# EasyEDA Pro project ProPrj_三轮车_2025-08-24.epro, board PCB1
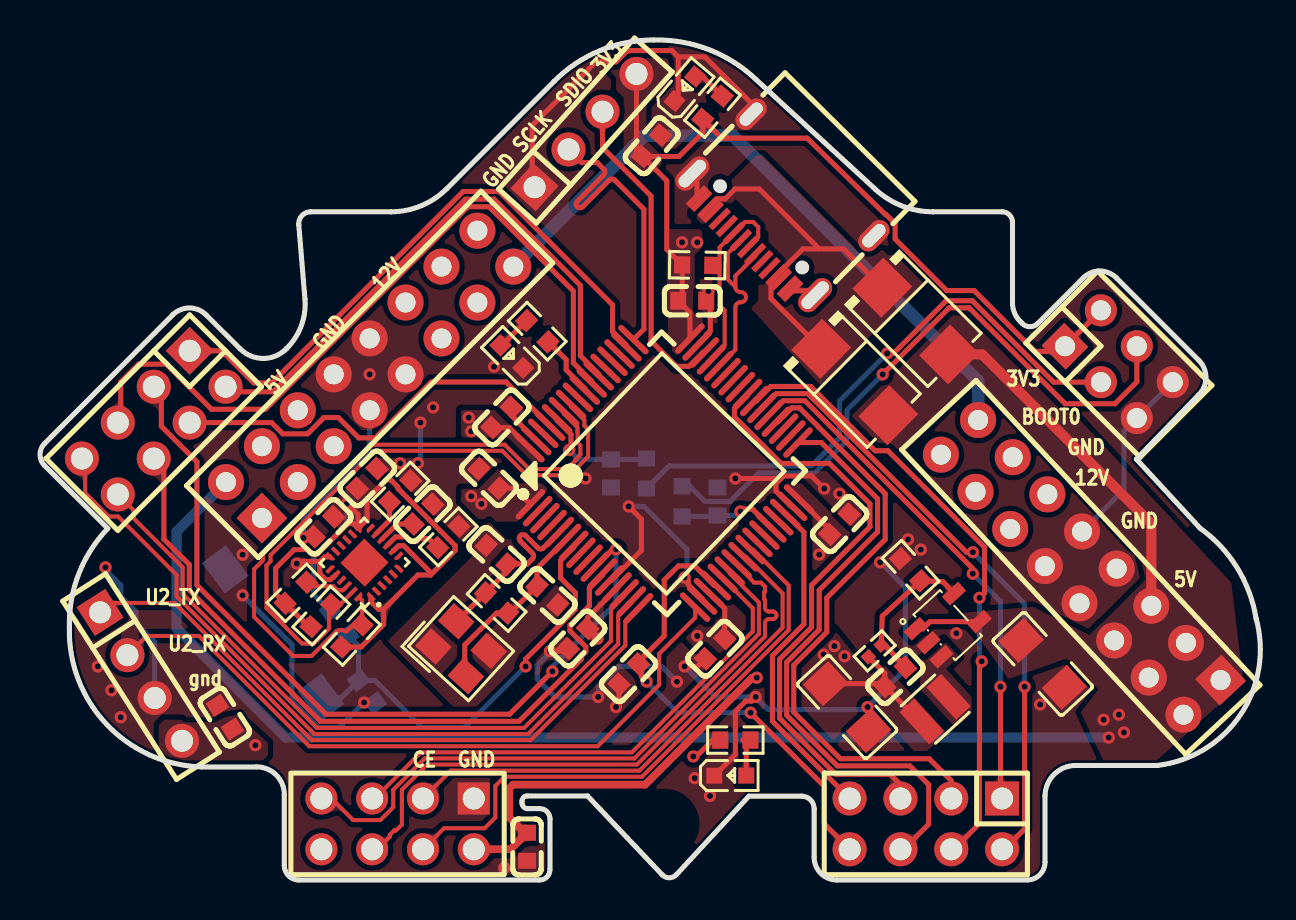
[diagram p6: board, top side]
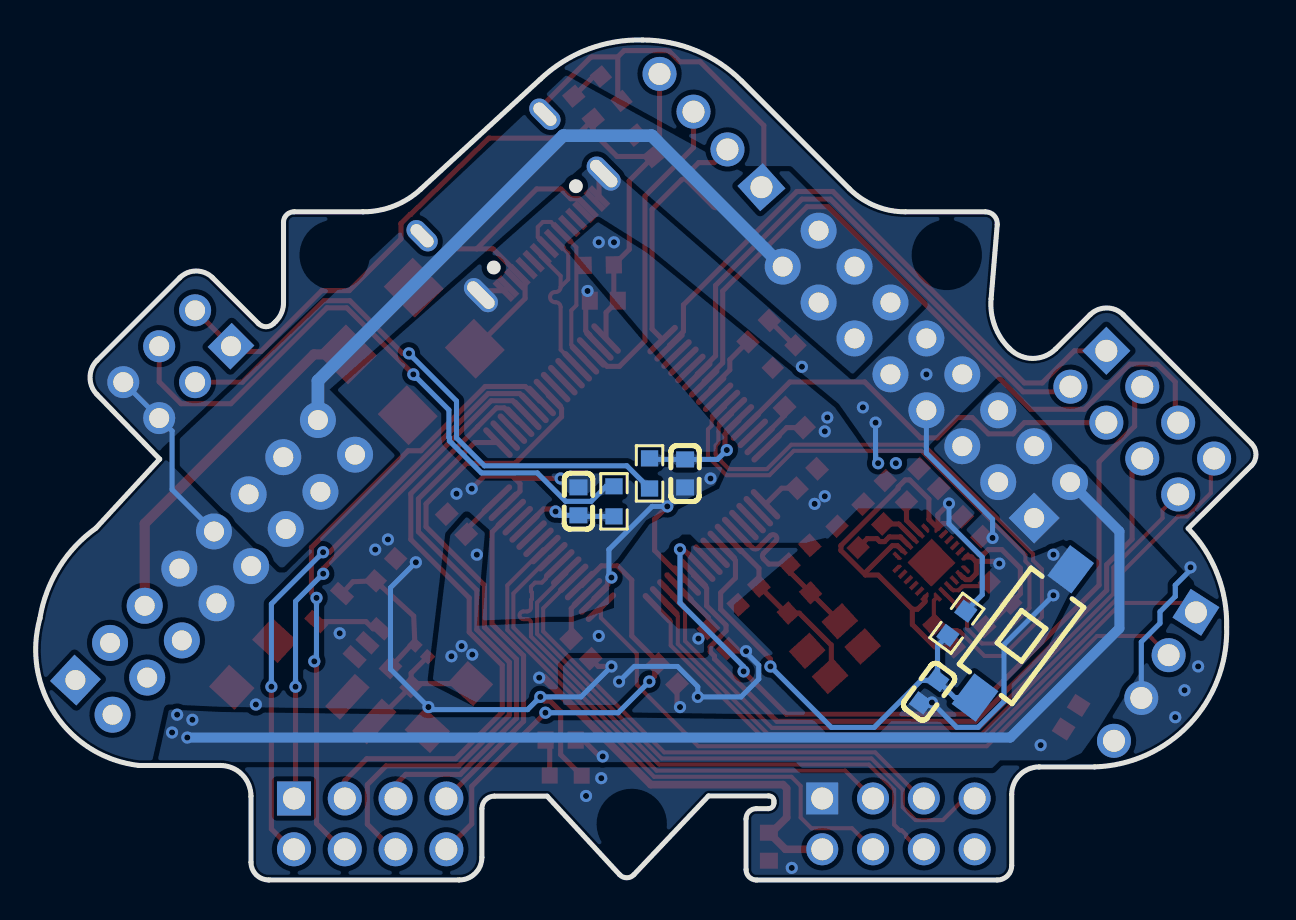
[diagram p7: board, bottom side, seen from below]

Outline 61.02 x 42.01 mm; copper layers: Top Layer, Bottom Layer. Coordinates in mm from the lower left corner of the outline.
Outline path: 0.23,21.82 6.63,28.26 arc(7.47,28.61) 8.3,28.26 10.02,26.55 arc(11.16,26.08) 12.31,26.56 12.35,26.6 arc(13.07,27.72) 13.25,29.05 12.94,32.77 arc(13.09,33.22) 13.53,33.41 17.54,33.41 arc(19.06,33.71) 20.34,34.57 25.71,39.94 arc(27.98,41.47) 30.67,42.01 arc(33.43,41.53) 35.8,40.03 41.77,34.54 arc(43.11,33.7) 44.65,33.41 48.11,33.41 arc(48.48,33.26) 48.63,32.89 48.63,28.86 arc(48.73,28.36) 49.01,27.94 49.12,27.83 arc(49.5,27.67) 49.88,27.83 52.17,30.11 arc(53,30.45) 53.82,30.11 57.95,25.98 arc(58.3,25.14) 57.96,24.29 54.82,21.05 58.01,17.59 arc(59.86,15.62) 60.81,13.09 arc(60.03,8.27) 55.85,5.73 51.79,5.73 arc(50.7,5.28) 50.26,4.19 50.26,0.89 arc(50,0.26) 49.37,0 39.84,0 arc(39.04,0.33) 38.71,1.14 38.71,3.57 arc(38.53,4.01) 38.08,4.19 35.45,4.19 31.82,0.27 arc(31.47,0.11) 31.11,0.26 27.38,4.2 24.36,4.2 arc(24.18,4.13) 24.1,3.95 24.1,3.85 arc(24.19,3.65) 24.38,3.57 24.99,3.57 arc(25.35,3.42) 25.5,3.06 25.5,0.52 arc(25.35,0.15) 24.98,0 12.94,0 arc(12.43,0.21) 12.22,0.72 12.22,4.28 arc(11.81,5.25) 10.84,5.66 8.06,5.66 arc(3.32,7.79) 1.47,12.66 arc(1.94,15.31) 3.39,17.58 0.23,20.72 arc(0,21.27) 0.23,21.82
Stack: Top Layer 0.035mm / Dielectric1 1.51mm FR4 er 4.5 / Bottom Layer 0.035mm

## Design rules (mm)
net PA12: DP1
net PA11: DP1
template: 自定义配置
spacing copperThickness1oz (default): track to track 0.102, other pairs 0.152 to 0.3
spacing copperThickness2oz: track to track 0.203, other pairs 0.152 to 0.3
track width copperThickness1oz (default): min 0.127, default 0.254, max 2.54
track width copperThickness2oz: min 0.203, default 0.254, max 2.54
differential pair differentialPair (default): width min 0.127, default 0.254, max 2.54; gap min 0.152, default 0.152
via viaSize (default): diameter min 0.5, default 0.61, max 10; hole min 0.3, default 0.305, max 6.3

## Placement (name value [footprint] x y rotation side)
C16  20PF  [C0603]  22.83 16.27 317.7 top
C17  20PF  [C0603]  25.37 14.24 137.7 top
C20  100nF  [C0603]  16.34 9.42 126.5 bottom
C21  100nF  [C0603]  28.55 20.33 90 bottom
C22  100nF  [C0603]  33.88 18.94 270 bottom
C25  22uF  [C1206]  50.14 10.81 132.6 top
C26  22uF  [C1206]  40.36 8.65 312.6 top
C27  100pF  [C0603]  42.76 10.16 222.6 top
C32  100nF  [C0603]  30.58 36.72 229.8 top
C64  100nF  [C0603]  23.09 23.13 226.1 top
C65  100nF  [C0603]  24.36 1.66 90 top
C66  100nF  [C0603]  39.98 17.79 226.1 top
C67  100nF  [C0603]  26.9 12.08 46.1 top
C68  100nF  [C0603]  22.45 20.08 316.1 top
C69  100nF  [C0603]  33.75 11.57 46.1 top
C70  100nF  [C0603]  32.61 28.97 180 top
C71  10nF  [C0603]  14.2 17.67 45.2 top
C72  100nF  [C0603]  16.36 20.08 225.2 top
C73  100nF  [C0603]  19.15 18.3 45.2 top
C74  100nF  [C0603]  9.24 8.14 302.5 top
C75  100nF  [C0603]  29.44 10.3 46.1 top
D1  VS-10BQ015HM3/5BT  [SMB_L4.6-W3.6-LS5.3-RD]  43.79 27.95 315 top
D2  VS-10BQ015HM3/5BT  [SMB_L4.6-W3.6-LS5.3-RD]  40.74 24.9 315.3 top
H7  -  [HDR-TH_6P-P2.54-V-F-R2-C3-S2.54]  53.95 25.79 315 top
H8  PZ254V-11-04P  [HDR-TH_4P-P2.54-V-M]  27.28 37.48 48 top
H9  PZ254V-12-8P  [HDR-TH_8P-P2.54-V-M-R2-C4-S2.54]  5.69 22.87 225 top
H10  PZ254V-12-8P  [HDR-TH_8P-P2.54-V-M-R2-C4-S2.54]  44.3 2.81 180 top
J1  2.54-2*8P母  [HDR-TH_16P-P2.54-V-F-R2-C8-S2.54]  52.04 15.63 133 top
J2  2.54-2*8P母  [HDR-TH_16P-P2.54-V-F-R2-C8-S2.54#2]  16.48 25.29 45 top
L3  2.2uH  [IND-SMD_L2.5-W2.0_MHCD252012A]  44.76 8.54 222.6 top
LED3  XL-1608SURC-06  [LED0603-RD_RED]  34.52 5.22 0 top
LED9  XL-1608SURC-06  [LED0603-RD_RED]  32.24 39.57 49.8 top
LED10  XL-1608SURC-06  [LED0603-RD_RED]  23.59 26.17 135 top
R5  10kΩ  [R0603]  34.77 7 0 top
R13  10kΩ  [R0603]  22.83 13.86 317.7 top
R14  10kΩ  [R0603]  14.96 12.84 126.5 bottom
R15  10kΩ  [R0603]  32.1 18.94 90 bottom
R16  10kΩ  [R0603]  30.33 20.33 90 bottom
R31  450kΩ  [R0402]  41.74 11.46 222.6 top
R32  100kΩ  [R0603]  43.53 15.52 132.6 top
R45  10kΩ  [R0603]  33.63 38.62 49.8 top
R47  1.5kΩ  [R0603]  32.87 30.75 358.9 top
R48  10kΩ  [R0603]  12.8 14.36 44.2 top
R49  10kΩ  [R0603]  15.59 12.2 47 top
R50  10kΩ  [R0603]  14.07 13.22 47 top
R51  10kΩ  [R0603]  18.01 19.44 45.2 top
R52  10kΩ  [R0603]  20.42 17.16 45.2 top
R53  10kΩ  [R0603]  24.86 27.44 135 top
SW8  TS-1101-C-W  [SW-SMD_L6.0-W3.3-LS8.0]  11.66 12.33 126.7 bottom
U2  2.54-2*4  [HDR-TH_8P-P2.54-V-F-R2-C4-S2.54]  17.88 2.81 180 top
U24  ME3103AM5G  [SOT-23-5_L3.0-W1.7-P0.95-LS2.8-BR]  45.39 12.74 222.6 top
U33  STM32F103RCT6TR  [LQFP-64_L10.0-W10.0-P0.50-LS12.0-BL]  31.21 20.33 316.1 top
U34  MPU-9250  [QFN-24_L3.0-W3.0-P0.40-BL-EP]  16.23 15.87 45.5 top
U35  PM254-1-04-Z-8.5  [HDR-TH_4P-P2.54-V-F]  5.05 10.17 302.5 top
USB2  KH-TYPE-C-16P  [usb-c-smd_kh-type-c-16p]  36.93 33.54 135.3 top
X1  8MHz  [CRYSTAL-SMD_4P-L3.2-W2.5-BL]  21.05 11.57 317.7 top

## Footprints (pads in the part's own frame, mm; a bottom-side part is the same pattern mirrored in y, then rotated)
C0603
  rect 0.8x0.9 smd: 1(-0.7,0) 2(0.7,0)
C1206
  rect 1.485x1.728 smd: 1(-1.593,0) 2(1.593,0)
CRYSTAL-SMD_4P-L3.2-W2.5-BL
  rect 1.4x1.2 smd: 1(-1.1,-0.85) 2(1.1,-0.85) 3(1.1,0.85) 4(-1.1,0.85)
HDR-TH_4P-P2.54-V-F
  rect 1.7x1.7 hole 1.1: 1(-3.81,0)
  round 1.7 hole 1.1: 2(-1.27,0) 3(1.27,0) 4(3.81,0)
HDR-TH_4P-P2.54-V-M
  rect 1.7x1.7 hole 1.1: 1(-3.81,0)
  round 1.7 hole 1.1: 2(-1.27,0) 3(1.27,0) 4(3.81,0)
HDR-TH_6P-P2.54-V-F-R2-C3-S2.54
  rect 1.7x1.6 hole 1: 1(-2.54,-1.27)
  round 1.6 hole 1: 2(-2.54,1.27) 3(0,-1.27) 4(0,1.27) 5(2.54,-1.27) 6(2.54,1.27)
HDR-TH_8P-P2.54-V-F-R2-C4-S2.54
  rect 1.6x1.6 hole 1.1: 1(-3.81,-1.27)
  round 1.6 hole 1.1: 2(-3.81,1.27) 3(-1.27,-1.27) 4(-1.27,1.27) 5(1.27,-1.27) 6(1.27,1.27) 7(3.81,-1.27) 8(3.81,1.27)
HDR-TH_8P-P2.54-V-M-R2-C4-S2.54
  rect 1.7x1.7 hole 1.1: 1(-3.81,-1.27)
  round 1.7 hole 1.1: 2(-3.81,1.27) 3(-1.27,-1.27) 4(-1.27,1.27) 5(1.27,-1.27) 6(1.27,1.27) 7(3.81,-1.27) 8(3.81,1.27)
HDR-TH_16P-P2.54-V-F-R2-C8-S2.54
  rect 1.8x1.8 hole 1: 1(-8.89,-1.27)
  round 1.8 hole 1: 2(-8.89,1.27) 3(-6.35,-1.27) 4(-6.35,1.27) 5(-3.81,-1.27) 6(-3.81,1.27) 7(-1.27,-1.27) 8(-1.27,1.27) 9(1.27,-1.27) 10(1.27,1.27) 11(3.81,-1.27) 12(3.81,1.27) 13(6.35,-1.27) 14(6.35,1.27) 15(8.89,-1.27) 16(8.89,1.27)
HDR-TH_16P-P2.54-V-F-R2-C8-S2.54#2
  rect 1.8x1.8 hole 1: 1(-8.89,-1.27)
  round 1.8 hole 1: 2(-8.89,1.27) 3(-6.35,-1.27) 4(-6.35,1.27) 5(-3.81,-1.27) 6(-3.81,1.27) 7(-1.27,-1.27) 8(-1.27,1.27) 9(1.27,-1.27) 10(1.27,1.27) 11(3.81,-1.27) 12(3.81,1.27) 13(6.35,-1.27) 14(6.35,1.27) 15(8.89,-1.27) 16(8.89,1.27)
IND-SMD_L2.5-W2.0_MHCD252012A
  rect 1x2.2 smd: 1(0.913,0) 2(-0.913,0)
LED0603-RD_RED
  rect 0.8x0.8 smd: 1(-0.799,-0.004) 2(0.799,0.004)
LQFP-64_L10.0-W10.0-P0.50-LS12.0-BL
  oval 0.3x2 smd: 1(-3.75,-5.75) 2(-3.25,-5.75) 3(-2.75,-5.75) 4(-2.25,-5.75) 5(-1.75,-5.75) 6(-1.25,-5.75) 7(-0.75,-5.75) 8(-0.25,-5.75) 9(0.25,-5.75) 10(0.75,-5.75) 11(1.25,-5.75) 12(1.75,-5.75) 13(2.25,-5.75) 14(2.75,-5.75) 15(3.25,-5.75) 16(3.75,-5.75) 33(3.75,5.75) 34(3.25,5.75) 35(2.75,5.75) 36(2.25,5.75) 37(1.75,5.75) 38(1.25,5.75) 39(0.75,5.75) 40(0.25,5.75) 41(-0.25,5.75) 42(-0.75,5.75) 43(-1.25,5.75) 44(-1.75,5.75) 45(-2.25,5.75) 46(-2.75,5.75) 47(-3.25,5.75) 48(-3.75,5.75)
  oval 2x0.3 smd: 17(5.75,-3.75) 18(5.75,-3.25) 19(5.75,-2.75) 20(5.75,-2.25) 21(5.75,-1.75) 22(5.75,-1.25) 23(5.75,-0.75) 24(5.75,-0.25) 25(5.75,0.25) 26(5.75,0.75) 27(5.75,1.25) 28(5.75,1.75) 29(5.75,2.25) 30(5.75,2.75) 31(5.75,3.25) 32(5.75,3.75) 49(-5.75,3.75) 50(-5.75,3.25) 51(-5.75,2.75) 52(-5.75,2.25) 53(-5.75,1.75) 54(-5.75,1.25) 55(-5.75,0.75) 56(-5.75,0.25) 57(-5.75,-0.25) 58(-5.75,-0.75) 59(-5.75,-1.25) 60(-5.75,-1.75) 61(-5.75,-2.25) 62(-5.75,-2.75) 63(-5.75,-3.25) 64(-5.75,-3.75)
QFN-24_L3.0-W3.0-P0.40-BL-EP
  custom 0.2x0.506 smd: 1(-1,-1.427) 6(1,-1.427) 13(1,1.427) 18(-1,1.427)
  rect 0.2x0.505 smd: 2(-0.6,-1.427) 3(-0.2,-1.427) 4(0.2,-1.427) 5(0.6,-1.427) 14(0.6,1.427) 15(0.2,1.427) 16(-0.2,1.427) 17(-0.6,1.427)
  custom 0.506x0.2 smd: 7(1.427,-1) 12(1.427,1) 19(-1.427,1) 24(-1.427,-1)
  rect 0.505x0.2 smd: 8(1.427,-0.6) 9(1.427,-0.2) 10(1.427,0.2) 11(1.427,0.6) 20(-1.427,0.6) 21(-1.427,0.2) 22(-1.427,-0.2) 23(-1.427,-0.6)
  rect 1.7x1.7 smd: 25(0,0)
R0402
  rect 0.566x0.54 smd: 1(-0.433,0) 2(0.433,0)
R0603
  rect 0.806x0.864 smd: 1(-0.753,0) 2(0.753,0)
SMB_L4.6-W3.6-LS5.3-RD
  rect 2.047x2.192 smd: 1(-2.361,0) 2(2.361,0)
SOT-23-5_L3.0-W1.7-P0.95-LS2.8-BR
  rect 1.1x0.6 smd: 1(1.3,-0.95) 2(1.3,0) 3(1.3,0.95) 4(-1.3,0.95) 5(-1.3,-0.95)
SW-SMD_L6.0-W3.3-LS8.0
  rect 1.9x1.5 smd: 1(-4,0) 2(4,0)
usb-c-smd_kh-type-c-16p
  oval 1x2 hole 0.6x1.7: 1(-4.32,1.765) 2(4.32,1.765)
  oval 1x1.8 hole 0.6x1.4: 3(-4.32,-2.415) 4(4.32,-2.415)
  rect 0.3x1.3 smd: A1(-3.35,2.415) A4(-2.55,2.415) A5(-1.25,2.415) A6(-0.25,2.415) A7(0.25,2.415) A8(1.25,2.415) A9(2.55,2.415) A12(3.35,2.415) B1(3.05,2.415) B4(2.25,2.415) B5(1.75,2.415) B6(0.75,2.415) B7(-0.75,2.415) B8(-1.75,2.415) B9(-2.25,2.415) B12(-3.05,2.415)

## Nets
As in the schematic, except:
$3N1256: L3.2 U24.3
$3N1257: C27.1 R31.1 R32.1 U24.5

Pads without a net: U34 2 3 4 5 6 7 12 14 15 16 17 19 21 25; USB2 A5 A8 B5 B8

## Via types
v1: diameter 0.61, hole 0.305, Top Layer to Bottom Layer, 72 vias

## Routing (per net, layer and track width the routed paths; a pad name or vN(x,y) marks a point on that pad's centre or on a via; arc(x,y) is an arc through that point)
3V3: length 121.2
  Top Layer w0.254: C27.2 42.25,10.34 R31.2 ; C27.2 44,7.93 L3.1 ; C27.2 42.11,9.82 C26.1 ; U33.32 39.49,17.51 C66.2 ; U33.1 23.72,19.59 C68.2 ; 53.05,28.49 H7.1 50.99,26.43 49.76,26.43 46.71,29.48 45.34,29.48 42.76,32.05 42.76,32.82 42.3,33.28 42.27,33.28 38.36,37.1 34.09,37.1 R45.1 33.14,37.37 31.95,36.18 C32.2 ; C64.2 23.47,22.62 U33.64 ; 17.18,13.54 16.93,13.54 16.54,13.92 U34.1 ; 17.18,13.54 17.18,12.78 16.06,11.65 R49.1 ; 17.18,13.54 18.9,15.25 19.53,15.25 ; R50.1 13.43,12.67 11.78,14.31 11.78,15.59 12.71,16.52 13.39,16.52 13.62,16.29 13.86,16.29 15.36,17.79 15.37,17.79 15.4,17.83 15.67,17.83 U34.13 ; U34.13 15.91,18.27 v1(15.35,18.83) ; U34.13 16.36,18.03 16.36,19.05 17.32,20.01 17.54,20.01 17.89,19.65 17.89,19.58 20.76,16.72 20.76,16.48 19.53,15.25 ; C69.2 34.24,13.57 U33.19 ; C32.2 29.83,36.48 H8.4 ; C32.2 31.34,34.97 31.34,31.53 R47.1 32.11,29.17 C70.2 32.5,28.38 U33.48 ; C67.2 27.38,13.12 28.85,14.59 U33.13 ; 19.53,15.25 19.53,15.38 18.19,16.72 17.93,16.72 17.68,16.47 U34.8
  Top Layer w0.381: v1(35.84,10.12) 35.61,10.12 30.26,4.77 23.65,4.77 23.47,4.58 23.47,3.12 24.23,2.36 C65.2 23.53,1.54 U2.2
  Bottom Layer w0.254: R14.2 13.69,14.27 13.69,16.14 15.35,17.8 v1(15.35,18.83)
  vias: v1(21.44,23.13) v1(21.56,22.44) v1(21.56,19.19) v1(22.07,18.81) v1(27.88,12.07) v1(32.1,31.89) v1(32.87,31.89) v1(32.87,12.2) v1(38.96,16.27) v1(39.19,11.27) v1(39.72,11.7) v1(40.23,11.19)
5V2A: length 79.6
  Top Layer w0.254: v1(32.67,6.18) 32.82,6.18 33.64,7 ; U24.4 44.51,12.92 44.15,12.56 U24.1
  Top Layer w0.508: 45.46,26.28 47.11,26.28 55.57,17.82 J1.5
  Bottom Layer w0.508: v1(53.44,7.12) 12.29,7.12 6.83,12.59 6.83,17.43 J2.2
  vias: v1(10.77,6.74) v1(53.19,8.01) v1(53.95,8.27) v1(54.2,7.38)
12V: length 33
  Bottom Layer w0.635: J1.15 46.91,24.96 34.64,37.22 30.22,37.22 23.67,30.67
GND: length 123.8
  Top Layer w0.254: LED3.1 34.77,6.27 34.77,8.43 35.29,8.95 35.58,8.95 v1(35.79,9.16) ; v1(25.5,11.44) 26.28,11.44 C67.1 ; v1(28.8,8.65) 28.95,8.8 C75.1 ; C70.1 33.52,28.76 33.52,27.46 33.31,27.26 33.31,27.18 U33.47 ; USB2.1 38.54,29.47 37.61,29.47 37.4,29.68 ; 32.62,35.33 32.85,35.09 32.85,34.18 ; 14,15.93 12.95,15.93 v1(12.84,15.82) ; 14,15.93 13.99,15.91 13.99,15.33 14.29,15.02 14.52,15.02 14.62,15.12 14.65,15.12 U34.20 ; 14,15.93 14.23,16.16 U34.18 ; v1(32.23,15.12) 32.41,14.95 32.41,14.78 33.1,14.08 U33.18 ; 37.06,20.08 36.8,19.82 36.8,19.44 37.56,18.69 37.61,18.69 ; 37.06,20.08 v1(34.77,20.08) ; 37.06,20.08 37.18,20.2 38.58,20.2 v1(39.22,19.57) ; C64.1 23.57,23.22 24.82,21.98 ; v1(32.23,10.68) 32.88,10.68 C69.1 ; USB2.B1 32.85,34.18 ; 24.73,34.65 24.61,34.76 24.61,37.73 27.79,40.91 28.81,40.91 29.34,41.44 arc(29.43,41.46) 29.52,41.48 31.6,41.48 31.91,41.16 ; LED9.1 31.91,39.14 31.91,41.16 ; 31.91,41.16 33.2,41.16 arc(33.24,41.15) 33.27,41.13 35.56,38.85 USB2.4 ; U33.12 28.57,14.98 30.07,16.48 30.07,18.05 v1(29.44,18.68)
  Bottom Layer w0.254: v1(18.9,20.84) 19.02,20.97 v1(19.02,22.87) ; 56.64,24.9 54.2,22.45 54.2,19.52 J1.9 ; v1(10.13,14.24) 12.6,11.77 12.6,8.94 13.9,7.64 14.97,7.64 v1(16.21,8.88) ; U35.3 5.74,11.9 4.8,12.84 4.8,13.41 4.04,14.18 4.04,14.74 3.27,15.51 v1(3.27,15.63) ; v1(31.85,9.92) 31.09,10.68 28.93,10.68 27.91,9.66 v1(27.91,9.16) 25.75,9.16 24.86,10.05 24.86,10.74 25.5,11.38 v1(25.5,11.44) ; v1(32.23,15.12) 32.36,15.25 32.36,16.52 30.2,18.68 v1(29.44,18.68) ; v1(13.17,17.11) 13.17,18.04 16.48,21.35 J2.7 ; v1(42.01,15.89) 43.28,14.62 43.28,10.55 v1(41.38,8.65) 41.26,8.52 36.42,8.52 v1(35.79,9.16) 33.75,9.16 v1(32.23,10.68)
  vias: v1(2.89,10.68) v1(3.57,9.49) v1(4.04,8.14) v1(10.13,16.27) v1(16.48,25.29) v1(18.01,20.84) v1(19.66,23.63) v1(22.71,25.67) v1(23.21,0.61) v1(27.28,20.08) v1(32.74,5.09) v1(33.43,29.45) v1(33.5,4.2) v1(39.98,19.32) v1(43.41,17.03) v1(44.04,16.52) v1(45.82,12.34) v1(50.01,8.78)
BOOT0: length 6
  Top Layer w0.254: v1(26.46,21.5) 26.55,21.59 26.55,22.29 25.86,22.98 U33.60
  Bottom Layer w0.254: R16.2 30.27,21.03 C21.2 26.93,21.03 v1(26.46,21.5)
BOOT1: length 5
  Top Layer w0.254: v1(35.02,18.43) 35.15,18.55 35.62,18.55 U33.28
  Bottom Layer w0.254: R15.1 33.83,18.18 C22.2 34.83,18.23 v1(35.02,18.43)
CE: length 25.9
  Top Layer w0.203: U2.3 20.54,5.47 29.97,5.47 37.13,12.63 37.13,14.33 35.3,16.17 U33.24
CSN: length 28.6
  Top Layer w0.203: U33.25 35.64,16.53 37.44,14.73 37.44,12.5 30.1,5.16 23.23,5.16 22.77,4.7 22.77,3.12 22.24,2.59 20.2,2.59 U2.4
MISO: length 30.4
  Top Layer w0.203: U2.7 14.58,4.08 15.66,3 17.02,3 17.66,3.64 17.66,4.51 19.23,6.08 29.72,6.08 35.95,12.31 35.95,13.87 34.49,15.33 U33.22
MOSI: length 30.4
  Top Layer w0.203: 34.84,15.8 35.51,15.14 35.51,15.07 35.71,14.87 36.05,14.87 36.25,14.67 36.25,14.43 arc(36.25,14.41) 36.23,14.41 arc(36.21,14.4) 36.21,14.38 36.21,14.05 arc(36.21,14.03) 36.23,14.02 arc(36.25,14.02) 36.25,14 36.25,13.62 arc(36.31,13.48) 36.44,13.43 36.64,13.43 arc(36.83,13.24) 36.64,13.05 36.44,13.05 arc(36.31,12.99) 36.25,12.86 36.25,12.18 29.85,5.77 19.36,5.77 18.1,4.51 18.1,2.77 17.81,2.49 arc(17.79,2.48) 17.77,2.49 arc(17.74,2.5) 17.72,2.49 17.5,2.26 arc(17.49,2.24) 17.5,2.22 arc(17.51,2.19) 17.5,2.17 16.86,1.54 U2.6
MPU9250_SCL: length 31.4
  Top Layer w0.203: 14.45,13.64 14.45,12.57 13.7,11.83 13.1,11.83 11.33,13.6 11.33,15.73 11.53,15.94 11.53,16.25 16.74,21.46 23.11,21.46 24.33,20.24 26.48,20.24 27.4,21.17 27.4,22.54 27.22,22.72 27.22,23 26.55,23.67 26.55,23.78 ; R50.2 15,13.77 U34.23
  Top Layer w0.254: R50.2 14.45,13.64
MPU9250_SDA: length 32.9
  Top Layer w0.203: U34.24 16.11,13.98 16.11,13.21 15.33,12.44 15.25,12.44 15.19,12.5 14.93,12.5 14.88,12.44 14.81,12.44 13.58,11.2 12.66,11.2 10.7,13.16 10.7,15.54 11.15,15.99 11.15,16.3 16.61,21.77 23.24,21.77 24.46,20.55 26.35,20.55 26.78,20.98 26.78,21.03 27.02,21.27 27.02,21.73 26.88,21.87 26.88,22.42 26.87,22.43 26.87,22.64 26.2,23.31 U33.59
PA0: length 34.9
  Top Layer w0.203: U33.14 29.21,14.2 28.55,13.55 28.55,11.95 24.21,7.61 13.84,7.61 7.14,14.31 7.14,15.63 4.67,18.1 4.67,18.5 3.89,19.28
PA1: length 38.3
  Top Layer w0.203: U33.15 29.57,13.86 28.91,13.2 28.91,11.81 24.41,7.3 13.72,7.3 6.83,14.19 6.83,15.25 3.91,18.18 3.43,18.18 2.26,19.35 2.26,20.91 2.1,21.08
PA2: length 33.4
  Top Layer w0.203: 3,13.38 3.47,13.86 6.73,13.86 13.59,6.99 24.53,6.99 29.27,11.73 29.27,12.93 U33.16
PA3: length 35.2
  Top Layer w0.203: U35.2 5.33,12.2 7.95,12.2 13.46,6.69 27.89,6.69 30.96,9.76 30.96,11.32 32.76,13.11 32.76,13.64
PA4: length 23.7
  Top Layer w0.254: H10.8 39.22,2.81 39.22,4.68 v1(35.53,8.37) ; 33.8,14.72 33.72,14.72 32.74,15.71 31.93,15.71 31.21,15 31.21,12.2 30.07,11.06 30.07,10.19 v1(30.33,9.93)
  Bottom Layer w0.254: v1(30.33,9.93) 31.89,8.37 v1(35.53,8.37)
PA5: length 25.8
  Top Layer w0.203: U2.5 16.74,4.08 19.04,6.38 29.59,6.38 35.64,12.43 35.64,13.59 U33.21
PA11: length 9.8
  Top Layer w0.203: USB2.B7 35.76,31.2 34.77,30.21 34.77,29.66 ; 34.77,29.66 34.39,30.04 34.39,31.34 USB2.A7 ; 34.77,29.66 arc(34.84,29.48) 35.02,29.4 35.05,29.4 arc(35.3,29.15) 35.05,28.89 35.02,28.89 arc(34.84,28.82) 34.77,28.64 34.77,26.52 U33.44
PA12: length 9.8
  Top Layer w0.203: U33.45 33.58,26.11 34.24,26.77 34.24,28.48 33.98,28.74 33.98,31.64 35.25,32.91 35.66,32.91 35.91,32.65 35.91,32.15 USB2.A6
PA13: length 15.9
  Top Layer w0.254: H8.3 28.13,36.63 30.55,34.2 30.55,26.96 31.83,25.69 32.45,25.69 33.14,26.38 U33.46
PA14: length 15.9
  Top Layer w0.254: 29.67,27.02 30.2,27.55 30.2,33.54 28.74,35 arc(28.6,35.06) 28.47,35 27.14,33.67 arc(26.87,33.67) 26.87,33.94 28.2,35.27 arc(28.25,35.41) 28.2,35.54 27.86,35.88 27.09,35.88 26.43,36.53
PA15: length 30.5
  Top Layer w0.254: H9.1 9.08,26.46 10.69,24.86 11.59,24.86 21.16,34.43 22.96,34.43 28.63,28.76 28.63,27.43 29.33,26.74 U33.50
PB3: length 36.9
  Top Layer w0.254: 3.89,22.87 4.04,23.02 4.04,24.9 4.93,25.79 5.22,25.79 5.22,25.8 6.32,25.8 8.58,23.54 11.27,23.54 21.4,33.67 22.45,33.67 26.67,29.45 26.67,25.86 27.59,24.94 27.59,24.86
PB4: length 3
  Top Layer w0.254: U33.56 27.24,24.58 26.31,25.51 26.31,26.02 25.54,26.8
PB8: length 21.1
  Top Layer w0.254: H9.4 11.58,22.87 12.14,22.31 13.38,22.31 14.2,23.13 14.92,23.13 15.94,22.11 16.77,22.11 19.57,24.9 23.31,24.9 25.51,22.7
PB11: length 16.9
  Top Layer w0.254: H10.7 36.62,7.94 36.62,11.22 38.2,12.8 38.2,17.39 37.26,18.33
PB12: length 30.3
  Top Layer w0.254: U33.33 39.07,21.88 41.88,19.06 41.88,17.41 38.96,14.49 38.96,12.52 37.34,10.89 37.34,8.24 39.87,5.71 43.5,5.71 44.44,4.77 44.44,2.79 43.18,1.54 H10.6
PB15: length 30.5
  Top Layer w0.254: H10.3 45.57,4.97 44.47,6.06 40.02,6.06 37.69,8.39 37.69,10.74 39.34,12.4 39.34,14.11 42.26,17.03 42.26,19.32 38.92,22.66 38.92,22.67 37.98,23.61 37.59,23.61 36.9,22.92 U33.36
PC2: length 41
  Top Layer w0.254: v1(25.62,10.43) 23.48,8.29 14.3,8.29 7.85,14.74 7.85,20.91 6.07,22.69 6.07,24.29 H9.3 ; U33.10 28.75,16.65 28.8,16.65
  Bottom Layer w0.254: v1(28.8,16.54) 28.8,13.86 25.62,10.68 v1(25.62,10.43)
PC3: length 36.3
  Top Layer w0.254: H9.6 6.2,20.57 6.2,17.04 7.47,15.77 7.47,14.49 14.02,7.94 23.95,7.94 27.08,11.06 27.08,11.2 27.29,11.41 27.29,11.66 26.5,12.45 26.5,12.74 27.47,13.71 27.47,14.59 28.13,15.25 U33.11
PC6: length 26.1
  Top Layer w0.254: v1(48.03,9.66) 48.03,4.15 H10.1 ; U33.37 37.17,23.97 38.25,23.97 46.65,15.57 v1(46.65,15.32)
  Bottom Layer w0.254: v1(48.03,9.66) 48.03,13.93 v1(46.65,15.32)
PC7: length 30.6
  Top Layer w0.254: v1(46.65,16.39) 46.33,16.39 38.4,24.32 36.82,24.32 U33.38 ; v1(49.23,9.66) 49.23,2.55 48.22,1.54 H10.2
  Bottom Layer w0.254: v1(49.23,9.66) 49.23,13.81 v1(46.65,16.39)
PC8: length 31.1
  Top Layer w0.254: H10.4 45.69,1.54 46.98,2.82 46.98,10.82 v1(47.09,10.93) ; v1(46.98,14.11) 47.23,14.36 47.23,16.63 42.4,21.46 41.76,21.46 38.54,24.68 36.54,24.68 35.82,23.95 U33.39
  Bottom Layer w0.254: v1(47.09,10.93) 46.98,11.04 v1(46.98,14.11)
PC9: length 30.7
  Top Layer w0.254: 35.38,24.3 35.38,24.22 34.72,23.57 34.72,23.17 37.06,20.83 39.48,20.83 41.5,18.81 41.5,17.67 38.58,14.74 38.58,12.64 36.98,11.04 36.98,8.09 39.79,5.28 42.52,5.28 43.03,4.77 H10.5
PD2: length 28.5
  Top Layer w0.254: H9.2 9.53,24.41 11.65,24.41 21.28,34.05 22.71,34.05 27.02,29.73 27.02,26.21 27.94,25.3 U33.54
STM32_OSC_IN: length 9.4
  Top Layer w0.254: X1.4 20.85,12.94 R13.1 23.35,15.44 C16.2 24.36,15.8 24.63,16.07 arc(24.69,16.2) 24.63,16.33 24.02,16.94 arc(24.02,17.21) 24.29,17.21 24.9,16.6 arc(25.03,16.55) 25.17,16.6 U33.5
STM32_OSC_OUT: length 9.4
  Top Layer w0.254: U33.6 24.85,15.58 C17.2 23.5,13.35 R13.2 22.83,13.35 21.24,11.75 21.24,10.26 X1.2
STM32_RST: length 22.9
  Top Layer w0.254: v1(24.28,10.68) 24.28,11.05 26.77,13.54 26.77,14.36 26.03,15.1 26.03,15.97 26.69,16.63 U33.7
  Bottom Layer w0.254: R14.1 15.93,11.71 15.93,9.98 ; 15.93,9.98 16.74,9.98 19.09,7.63 21.23,7.63 v1(24.28,10.68) ; 15.93,9.98 15.07,9.13 SW8.1
$1N2704: length 32
  Top Layer w0.254: v1(42.14,25.29) 45.46,28.61 46.47,28.61 51.26,23.82 53.75,23.82 54.85,24.91 54.85,26.69
  Bottom Layer w0.254: 42.07,25.09 41.95,25.09 40.36,23.51 40.36,22.14 40.33,22.11 40.33,21.96 38.73,20.36 35.94,20.36 34.52,18.94 33.25,18.94 32.49,19.69 R15.2
$1N2705: length 29.4
  Top Layer w0.254: 53.05,24.9 50.69,24.9 46.61,28.97 45.31,28.97 42.68,26.33 v1(42.36,26.33)
  Bottom Layer w0.254: v1(42.36,26.33) 39.98,23.95 39.98,22.11 38.58,20.71 31.46,20.71 R16.1
$3N1247: length 1.8
  Top Layer w0.254: 35.14,7 35.32,6.82 LED3.2
$3N1257: length 7.7
  Top Layer w0.254: 45.7,14.32 45.16,14.92 44.04,14.96 42.12,13.2 R31.1 42.26,11.74 43.28,10.63
$3N1262: length 1.8
  Top Layer w0.254: R45.2 33.12,40.18 LED9.2
$3N6377: length 1.8
  Top Layer w0.254: LED10.2 23.09,26.74 R53.2
$5N2391: length 2.2
  Top Layer w0.203: R48.2 13.54,14.69 14.67,14.69 14.87,14.49 15.15,14.49 15.3,14.65
$5N2776: length 1.9
  Top Layer w0.254: 17.08,17.03 17.86,17.8 C73.1
$5N2819: length 1.9
  Top Layer w0.254: U34.11 17.48,17.99 17.48,18.91
$5N2858: length 3
  Top Layer w0.254: R52.1 19.44,17.07 18.96,17.07 18.81,16.92 18.57,16.92 18.34,17.16 17.78,17.16 U34.9
$6N1315: length 18.6
  Top Layer w0.254: 38.97,31.56 35.97,34.56 34.76,34.56 34.27,34.07 33.87,34.07 USB2.A9 ; 38.97,31.56 38.15,31.56 36.83,30.24 36.55,29.96 36.55,29.08 D2.1 ; 38.97,31.56 40.18,31.56 42.12,29.62

## Copper pours and planes (outline as drawn; the poured copper is in the pictures)
3V3 on Top Layer: 17.3,16.95 16.99,16.65 16.69,16.95 16.57,16.95 16.07,16.45 16.06,16.45 13.89,18.62 15.6,20.33 16.48,20.33 17.23,19.58 17.23,19.41 16.58,18.75 17.83,17.5 17.92,17.5 17.37,16.95
3V3 on Top Layer: 27.66,11.7 26.61,12.74 27.34,13.47 27.66,13.47 27.66,13.73 29.31,15.38 29.31,15.51 29.56,15.51 29.69,15.38 29.69,15.14 28.44,13.89 28.44,12.1 28.04,11.7
3V3 on Top Layer: 21.05,23.51 22.72,23.51 23.37,22.85 23.49,22.85 25.25,21.09 25.37,21.09 25.12,20.84 24.68,20.84 23.47,22.05 22.77,22.05 22.71,21.98 21.31,21.98 21.05,22.24
3V3 on Top Layer: 31.34,32.52 31.34,28.59 31.21,28.46 31.39,28.28 31.39,27.1 31.6,26.9 31.6,26.17 32.03,26.17 33.5,27.65 33.5,27.7 32.74,28.46 32.74,31.25 33.12,31.64 33.12,32.55 31.36,32.55
3V3 on Top Layer: 37.4,20.11 36.99,19.7 36.93,19.7 37.91,18.72 37.97,18.72 38.45,18.24 38.45,18.05 38.63,17.87 38.63,15.48 38.71,15.4 38.71,15.38 40.49,17.16 40.49,17.43 37.8,20.11
3V3 on Top Layer: 35.53,12.97 34.48,11.27 32.76,11.56 32.06,12.32 33.97,13.3 33.97,13.49 33.75,13.7 33.75,13.73 32.48,15 32.8,15.31 34.12,13.98 34.52,13.98
3V3 on Top Layer: 28.42,40.71 28.42,40.53 28.8,40.14 28.8,39.51 29.18,39.13 29.18,35.95 29.83,35.31 30.59,35.31 31.08,35.81 31.08,36.21 30.33,36.97 30.33,36.97 30.33,38.75 31.47,39.89 31.47,41.16 31.21,41.41 29.12,41.41
3V3 on Top Layer: 42.26,10.72 45.34,7.36 44,6.12 41.91,8.39 41.23,8.42 39.65,6.97 37.07,9.79 39.69,12.56 41.5,10.3 42.25,10.72
3V3 on Top Layer: 21.05,19.57 21.93,19.57 22.95,20.59 22.96,20.59 23.71,19.84 25.1,19.84 25.37,19.57 25.37,19.33 23.96,17.92 22.79,17.92 22.45,18.05 21.93,18.05 21.05,18.92
3V3 on Bottom Layer: 29.75,16.37 29.6,16.37 28.7,17.27 28.28,17.27 27.88,16.86 21.6,16.86 19.89,18.57 16.87,18.57 15.34,17.05 13.76,18.63 16.23,21.09 19.15,21.09 19.53,21.48 21.05,23.63 30.44,31.36 32.91,32.91 34.33,31.67 25.88,21.73 26.86,19.57 30.33,17.79 31.72,15.89 32.1,15.51 32.1,13.6 34.2,12.9 35.46,12.9 36.57,12.82 38.96,12.71 38.56,17.36 39.47,18.17 40.29,17.25 41.16,10.02 38.26,8.52 34.91,8.52 34.91,10.81 34.36,11.35 27.6,11.35 27.6,12.25 27.93,12.58 28.92,12.58 29.75,13.4
5V2A on Top Layer: 11.4,6.86 10.21,7.95 9.99,8.29 9.24,8.15 8.74,7.89 7.21,7.89 7.08,8.01 6.2,8.01 5.94,7.76 5.94,6.61 6.57,5.98 11.15,5.98 11.4,6.23
5V2A on Top Layer: 47.05,28.33 45.82,28.33 45.76,28.4 40.49,23.13 42.07,21.54 43.35,21.54 46.8,24.98 54.53,16.69 54.96,16.4 55.29,15.03 53.1,12.84 53.06,12.84 52.47,12.25 49.64,13.67 46.05,13.35 48.43,10.05 51.28,11.06 52.93,9.54 52.04,8.39 53.16,5.98 55.84,5.98 60.17,9.86 59.57,14.86
5V2A on Bottom Layer: 9.19,14.07 7.97,15.76 9.62,17.03 11.28,16.38 11.22,16.43 16.1,21.31 16.1,21.6 12.8,24.9 3.35,14.81 7.94,7.45 8.73,6.34 9.52,5.98 12.8,5.98 13.18,5.6 22.71,5.6 23,5.89 54.94,5.89 54.36,8.52 51.77,8.4 14.07,7.89 10.39,11.7
12V on Bottom Layer: 32.96,36.35 31.34,35.06 20.17,25.29 16.67,28.78 23.34,35.45 25.77,35.45 34.5,40.25 54.52,21.42 48.8,15.63 48.62,15.63 43.04,21.22 43.03,21.22 46.33,24.52
GND on Top Layer: -10.06,48.53 62.71,48.53 91.67,19.57 91.67,15.12 72.11,-4.43 -2.57,-4.43 -10.06,3.06
GND on Bottom Layer: -6.76,46.49 53.44,46.49 53.82,46.88 76.17,24.52 76.17,13.73 60.81,-1.64 7.21,-1.64 5.81,-3.04 -7.65,-3.04 -8.03,-3.42 -8.03,45.22
J_GND on Top Layer: 23.34,17.03 22.45,17.92 21.44,16.9 21.44,16.65 21.75,16.33 17.37,11.95 20.78,8.55 21.71,8.55 26.96,13.79 23.72,17.03
$3N1256 on Top Layer: 45.18,12.03 45.97,11.17 45.3,10.56 47.01,8.71 45.89,7.69 45.71,7.69 44,9.57 44.06,11
$6N1315 on Top Layer: 40.87,31.51 42.14,31.51 42.39,31.25 42.77,31.25 44.17,29.86 39.09,24.78 38.96,24.78 35.81,28.31 35.53,28.59 35.91,28.97 35.91,29.73 36.42,30.24 36.42,32.4 34.77,34.05 33.37,32.65 33.25,32.65 32.61,33.29 32.61,33.41 33.66,34.46 34.04,34.46 35.81,36.23 36.14,36.23

Small or netless copper shapes (teardrops, artwork), in the pictures only: 148 on Top Layer, 53 on Bottom Layer

## Text on the board
Top Silkscreen Layer: U2_TX | U2_RX | gnd | CE | GND | 3V3 | BOOT0 | 12V | 5V | SCLK | SDIO
